# Altium schematic sheet Altium - Maltron_S_Edition - Schematic.schdoc
size 311 x 274 mm
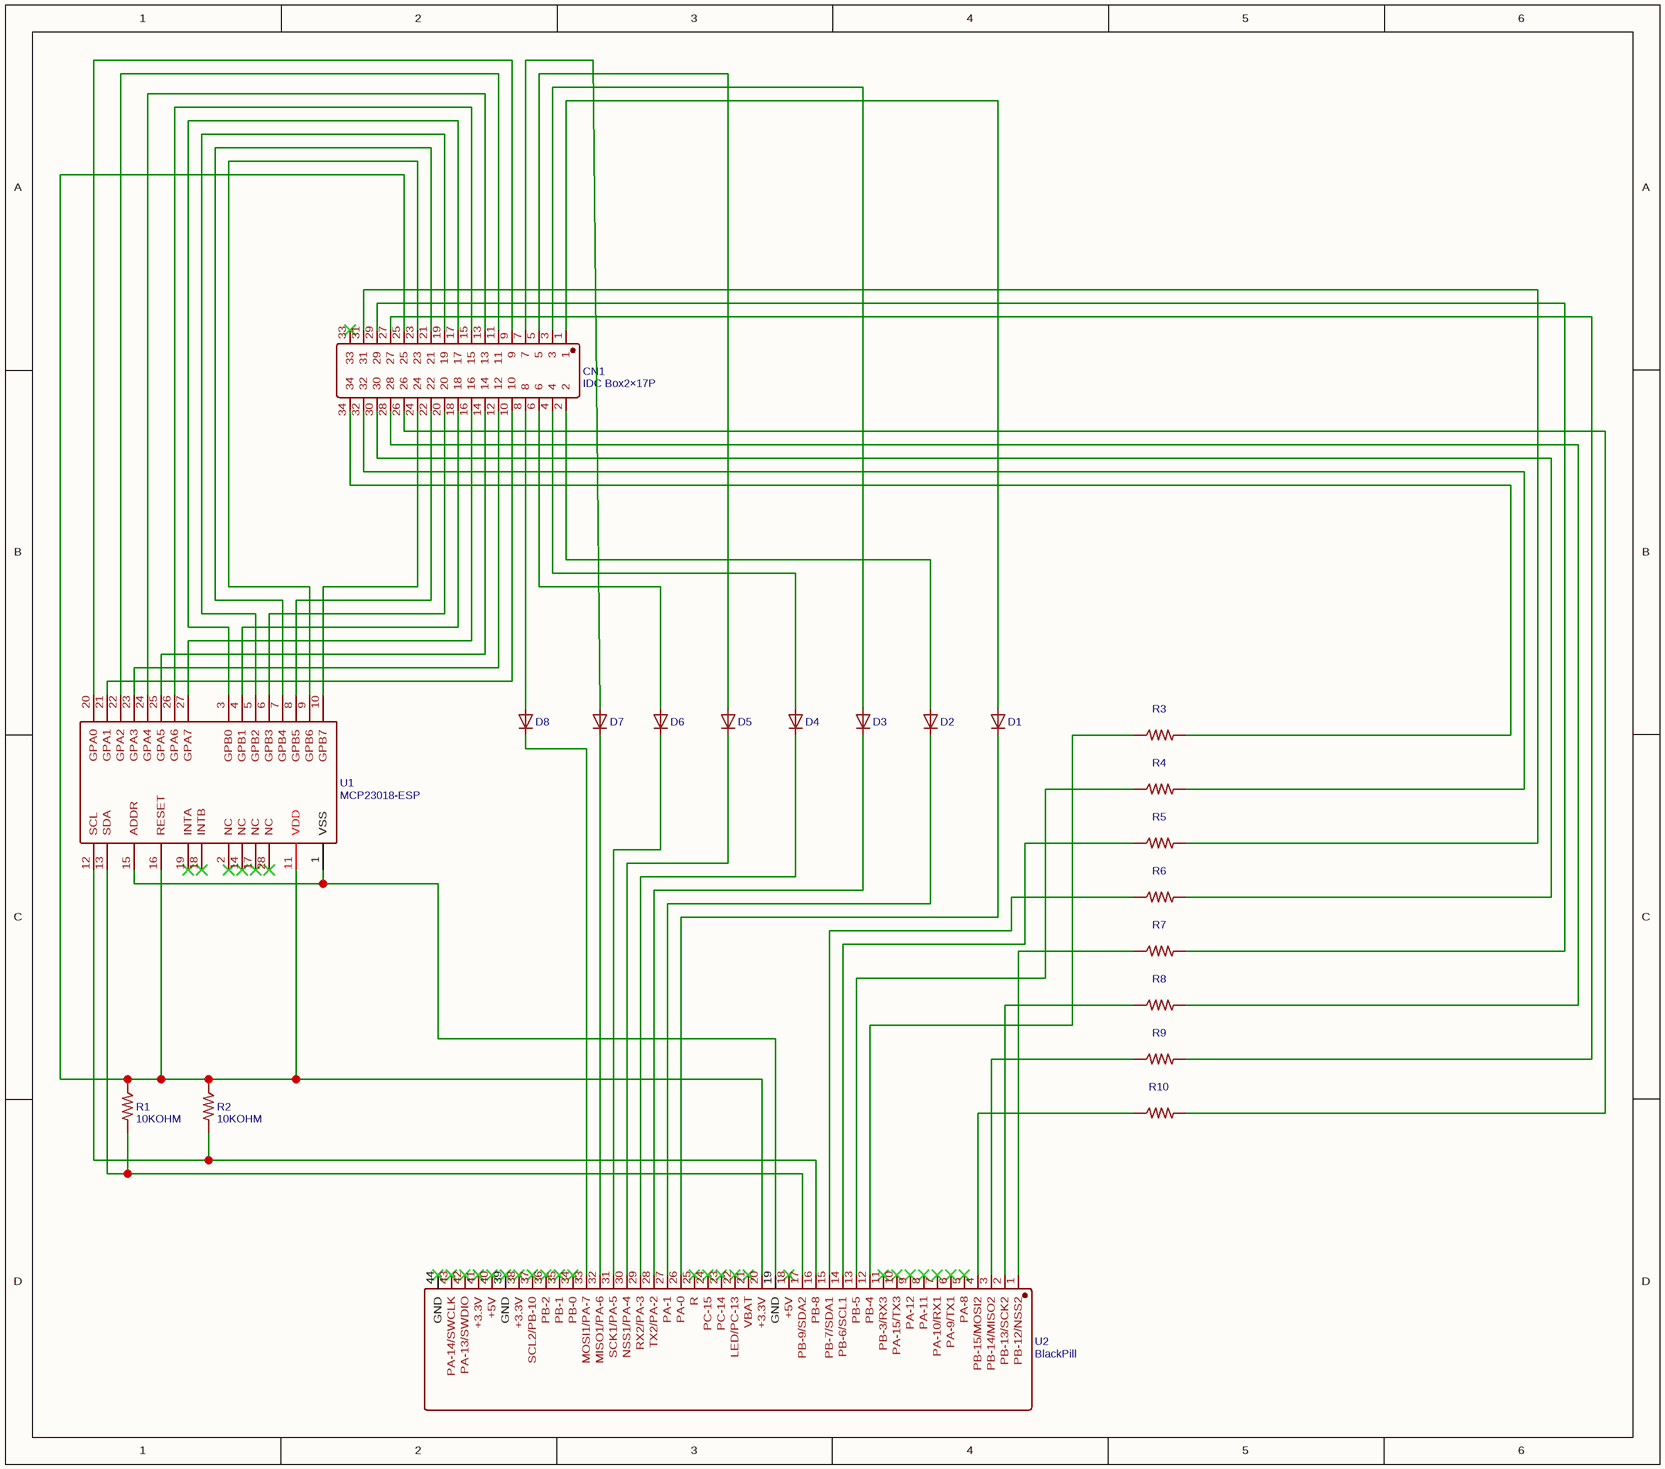
[diagram p0: Altium - Maltron_S_Edition - Schematic.schdoc]

## Parts
CN1  IDC Box2×17P  [IDC-TH_34P-P2.54_BOOMELE-2X17P]
D1  DIODE  [DO-1N4148]  (value not drawn)
D2  DIODE  [DO-1N4148]  (value not drawn)
D3  DIODE  [DO-1N4148]  (value not drawn)
D4  DIODE  [DO-1N4148]  (value not drawn)
D5  DIODE  [DO-1N4148]  (value not drawn)
D6  DIODE  [DO-1N4148]  (value not drawn)
D7  DIODE  [DO-1N4148]  (value not drawn)
D8  DIODE  [DO-1N4148]  (value not drawn)
R1  10KOHM  [AXIAL-0.3EZ]
R2  10KOHM  [AXIAL-0.3EZ]
R3  10OHM-1_4W-5%(PTH)HORIZ-KIT  [AXIAL-0.3EZ]  (value not drawn)
R4  10OHM-1_4W-5%(PTH)HORIZ-KIT  [AXIAL-0.3EZ]  (value not drawn)
R5  10OHM-1_4W-5%(PTH)HORIZ-KIT  [AXIAL-0.3EZ]  (value not drawn)
R6  10OHM-1_4W-5%(PTH)HORIZ-KIT  [AXIAL-0.3EZ]  (value not drawn)
R7  10OHM-1_4W-5%(PTH)HORIZ-KIT  [AXIAL-0.3EZ]  (value not drawn)
R8  10OHM-1_4W-5%(PTH)HORIZ-KIT  [AXIAL-0.3EZ]  (value not drawn)
R9  10OHM-1_4W-5%(PTH)HORIZ-KIT  [AXIAL-0.3EZ]  (value not drawn)
R10  10OHM-1_4W-5%(PTH)HORIZ-KIT  [AXIAL-0.3EZ]  (value not drawn)
U1  MCP23018-ESP  [DIP28]
U2  BlackPill  [BLACKPILL]

## Nets
NetCN1_1: CN1.1 D1.A
NetCN1_2: CN1.2 D2.A
NetCN1_3: CN1.3 D3.A
NetCN1_4: CN1.4 D4.A
NetCN1_5: CN1.5 D5.A
NetCN1_6: CN1.6 D6.A
NetCN1_7: CN1.7 D7.A
NetCN1_8: CN1.8 D8.A
NetCN1_9: CN1.9 U1.20(GPA0)
NetCN1_10: CN1.10 U1.21(GPA1)
NetCN1_11: CN1.11 U1.22(GPA2)
NetCN1_12: CN1.12 U1.23(GPA3)
NetCN1_13: CN1.13 U1.24(GPA4)
NetCN1_14: CN1.14 U1.25(GPA5)
NetCN1_15: CN1.15 U1.26(GPA6)
NetCN1_16: CN1.16 U1.27(GPA7)
NetCN1_17: CN1.17 U1.3(GPB0)
NetCN1_18: CN1.18 U1.4(GPB1)
NetCN1_19: CN1.19 U1.5(GPB2)
NetCN1_20: CN1.20 U1.6(GPB3)
NetCN1_21: CN1.21 U1.7(GPB4)
NetCN1_22: CN1.22 U1.8(GPB5)
NetCN1_23: CN1.23 U1.9(GPB6)
NetCN1_24: CN1.24 U1.10(GPB7)
NetCN1_25: CN1.25 R1.1 R2.1 U1.11(VDD) U1.16(RESET) U2.20(+3.3V)
NetCN1_26: CN1.26 R10.2
NetCN1_27: CN1.27 R9.2
NetCN1_28: CN1.28 R8.2
NetCN1_29: CN1.29 R7.2
NetCN1_30: CN1.30 R6.2
NetCN1_31: CN1.31 R5.2
NetCN1_32: CN1.32 R4.2
NetCN1_34: CN1.34 R3.2
NetD1_C: D1.C U2.26(PA-0)
NetD2_C: D2.C U2.27(PA-1)
NetD3_C: D3.C U2.28(TX2/PA-2)
NetD4_C: D4.C U2.29(RX2/PA-3)
NetD5_C: D5.C U2.30(NSS1/PA-4)
NetD6_C: D6.C U2.31(SCK1/PA-5)
NetD7_C: D7.C U2.32(MISO1/PA-6)
NetD8_C: D8.C U2.33(MOSI1/PA-7)
NetR1_2: R1.2 U1.13(SDA) U2.17(PB-9/SDA2)
NetR2_2: R2.2 U1.12(SCL) U2.16(PB-8)
NetR3_1: R3.1 U2.12(PB-4)
NetR4_1: R4.1 U2.13(PB-5)
NetR5_1: R5.1 U2.14(PB-6/SCL1)
NetR6_1: R6.1 U2.15(PB-7/SDA1)
NetR7_1: R7.1 U2.1(PB-12/NSS2)
NetR8_1: R8.1 U2.2(PB-13/SCK2)
NetR9_1: R9.1 U2.3(PB-14/MISO2)
NetR10_1: R10.1 U2.4(PB-15/MOSI2)
NetU1_1: U1.1(VSS) U1.15(ADDR) U2.19(GND)

Not connected (* = marked no-connect by the designer): CN1 33*; U1 2(NC)* 14(NC)* 17(NC)* 18(INTB)* 19(INTA)* 28(NC)*; U2 5(PA-8)* 6(PA-9/TX1)* 7(PA-10/RX1)* 8(PA-11)* 9(PA-12)* 10(PA-15/TX3)* 11(PB-3/RX3)* 18(+5V)* 21(VBAT)* 22(LED/PC-13)* 23(PC-14)* 24(PC-15)* 25(R)* 34(PB-0)* 35(PB-1)* 36(PB-2)* 37(SCL2/PB-10)* 38(+3.3V)* 39(GND)* 40(+5V)* 41(+3.3V)* 42(PA-13/SWDIO)* 43(PA-14/SWCLK)* 44(GND)*

## Library data of the parts
CN1 = IDC Box2×17P: BOM_Manufacturer: BOOMELE; BOM_Manufacturer Part: IDC Box2×17P Right Angle; BOM_Supplier: LCSC; BOM_Supplier Part: C20920; BOM_JLCPCB Part Class: Extended Part; spicePre: C; spiceSymbolName: IDC Box2×17P
D1-D8 = DIODE: Contributor: Adafruit; spicePre: D; spiceSymbolName: DIODE
R1 R2 = 10KOHM: description: RES-09435; Contributor: SparkFun; spicePre: R; spiceSymbolName: 10KOHM-1_4W5%(PTH)HORIZ-KIT
R3-R10 = 10OHM-1_4W-5%(PTH)HORIZ-KIT: description: RES-10698; Contributor: SparkFun; spicePre: R; spiceSymbolName: 10OHM-1_4W-5%(PTH)HORIZ-KIT
U1 = MCP23018-ESP: description: 8-Bit IO Expander with Open-Drain Outputs, High-Speed I2C Interface, 28-Pin SPDIP, Extended Temperature; spicePre: U; spiceSymbolName: MCP23018-ESP
U2 = BlackPill: Contributor: Michael Schramm; spicePre: U; spiceSymbolName: BlackPill